# Altium schematic sheet Battery Management and Charging.SchDoc
size B; SheetNumber: 4; SheetTotal: 9
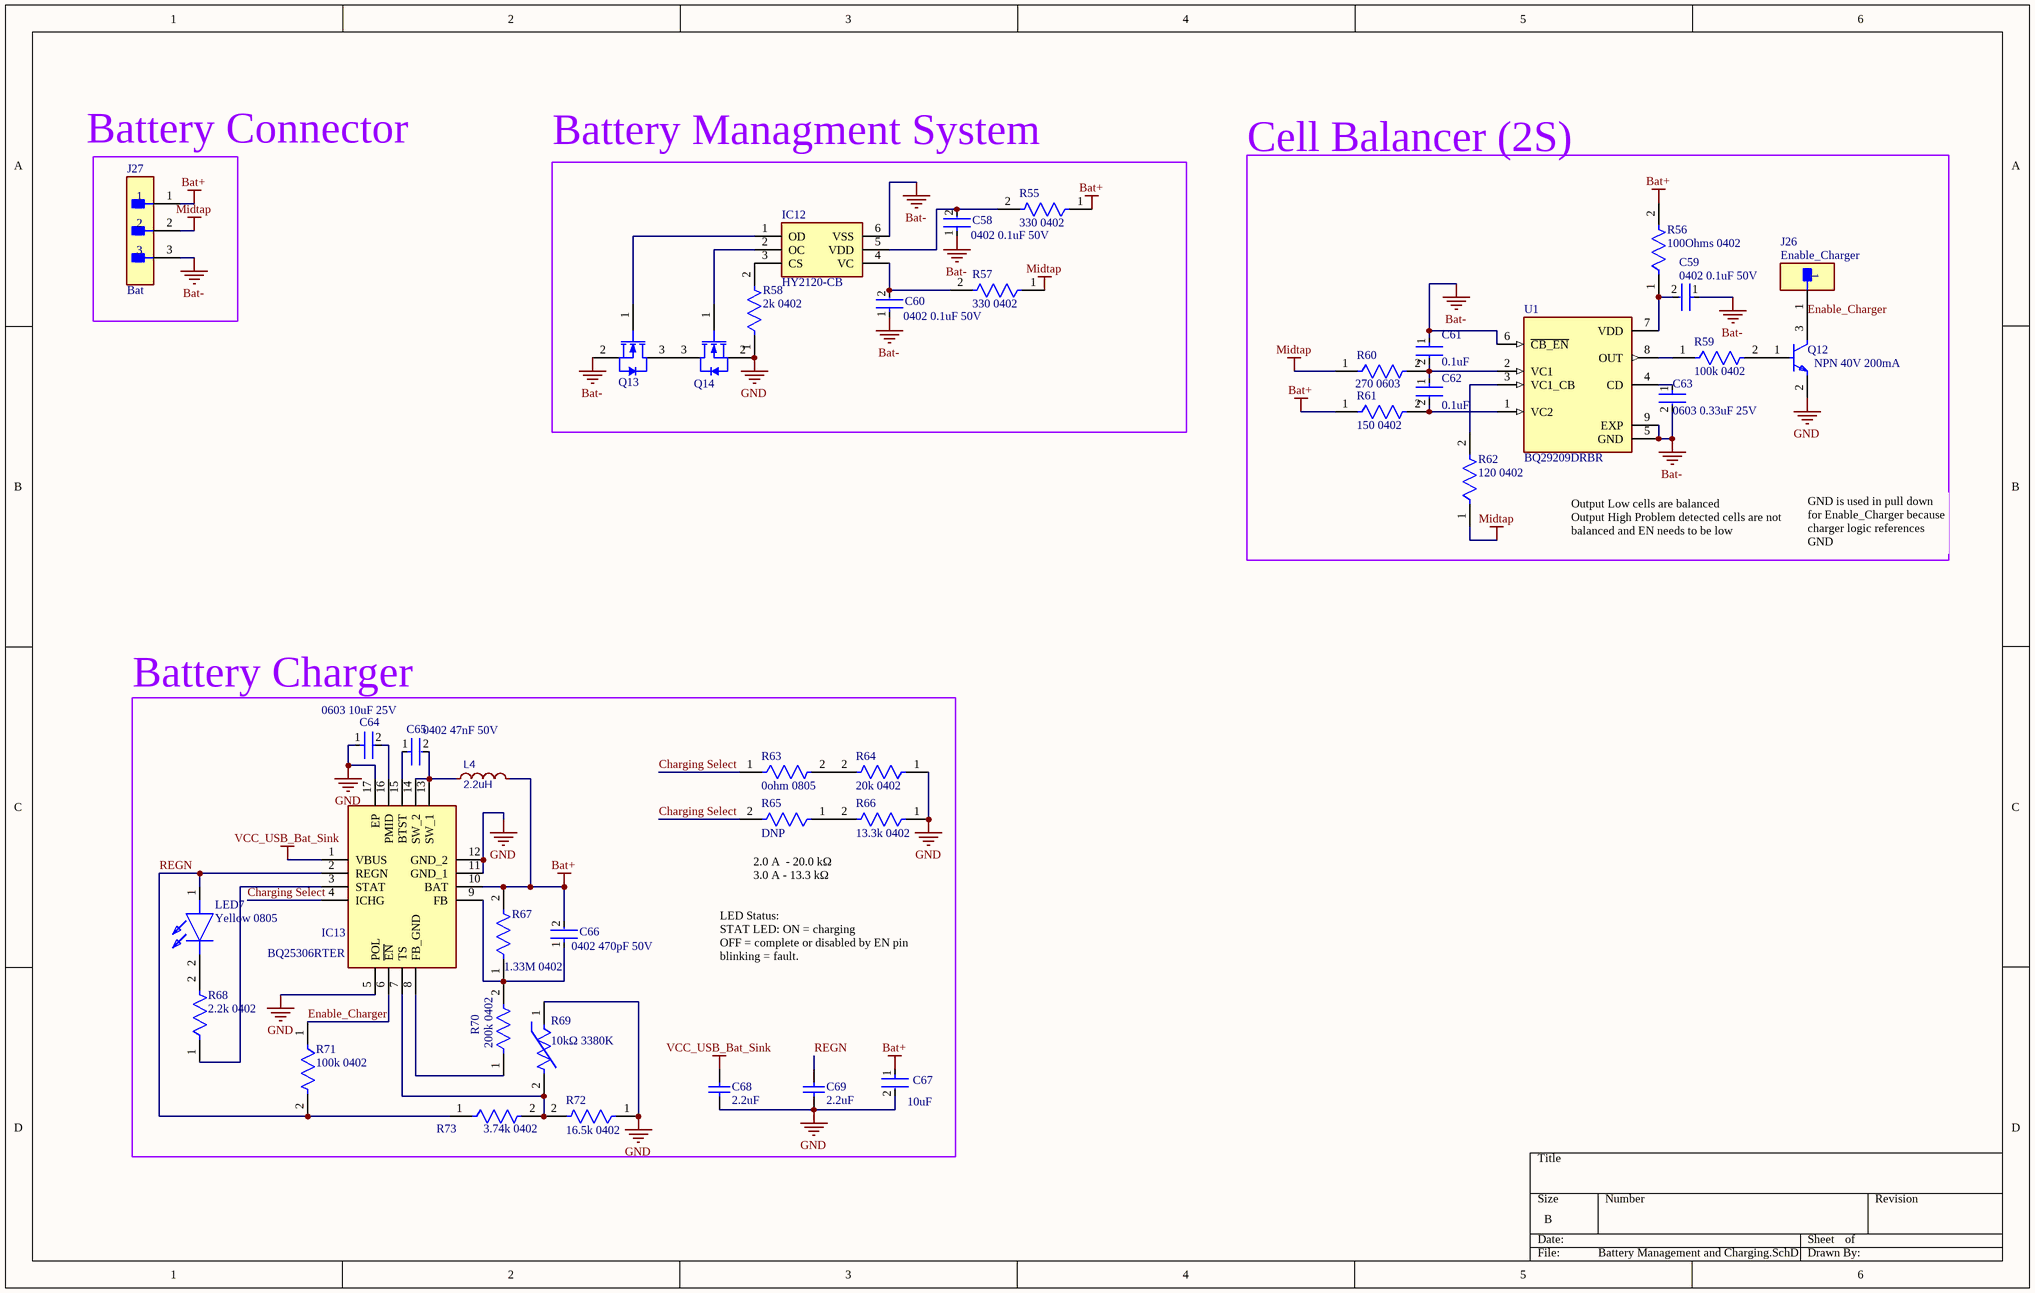
[diagram p0: Battery Management and Charging.SchDoc]

## Parts
C58  0402 0.1uF 50V  [FP-C0402-BB-MFG]
C59  0402 0.1uF 50V  [FP-C0402-BB-MFG]
C60  0402 0.1uF 50V  [FP-C0402-BB-MFG]
C61  0.1uF  [FP-C0402-BB-MFG]
C62  0.1uF  [FP-C0402-BB-MFG]
C63  0603 0.33uF 25V  [FP-CC0603-DC-MFG]
C64  0603 10uF 25V  [FP-CC0603-DC-MFG]
C65  0402 47nF 50V  [FP-C0402-BB-MFG]
C66  0402 470pF 50V  [FP-C0402-BB-MFG]
C67  10uF  [FP-CC0603-DC-MFG]
C68  2.2uF  [CAPC2013X94X50LL20T25]
C69  2.2uF  [CAPC2013X94X50LL20T25]
IC12  HY2120-CB  [SOT95P280X140-6N]
IC13  BQ25306RTER  [QFN50P300X300X80-17N-D]
J26  Enable_Charger  [FP-5015-MFG]
J27  Bat  [FP-TSW-103-14-G-S-MFG]
L4  2.2uH  [2.2uH]
LED7  Yellow 0805  [KT0805G]
Q12  NPN 40V 200mA  [FP-SOT23-IPC_A]
Q13  Discharge Protection  [ONSC-SOT-23-3-318-08_V]  (value not drawn)
Q14  Discharge Protection  [ONSC-SOT-23-3-318-08_V]  (value not drawn)
R55  330 0402  [FP-RMCF0402-MFG]
R56  100Ohms 0402  [FP-RMCF0402-MFG]
R57  330 0402  [FP-RMCF0402-MFG]
R58  2k 0402  [FP-RMCF0402-MFG]
R59  100k 0402  [FP-RMCF0402-MFG]
R60  270 0603  [FP-AC0603-MFG]
R61  150 0402  [FP-RMCF0402-MFG]
R62  120 0402  [FP-RMCF0402-MFG]
R63  0ohm 0805  [FP-RN73R2A-IPC_C]
R64  20k 0402  [FP-RMCF0402-MFG]
R65  DNP  [FP-RN73R2A-IPC_C]
R66  13.3k 0402  [FP-RMCF0402-MFG]
R67  1.33M 0402  [FP-RMCF0402-MFG]
R68  2.2k 0402  [FP-AF0402-IPC_B]
R69  10kΩ 3380K  [FP-NCP15-NCU15-0_05-IPC_A]
R70  200k 0402  [FP-RMCF0402-MFG]
R71  100k 0402  [FP-RMCF0402-MFG]
R72  16.5k 0402  [FP-RMCF0402-MFG]
R73  3.74k 0402  [FP-RMCF0402-MFG]
U1  BQ29209DRBR  [Cell Balancer]

## Blocks framed on the sheet
Battery Managment System: C58 C60 IC12 Q13 Q14 R55 R57 R58
Cell Balancer (2S): C59 C61-C63 J26 Q12 R56 R59-R62 U1
Battery Charger: C64-C69 IC13 L4 LED7 R63-R73

## Nets
Bat+: C66.2 C67.1 IC13.10(BAT) J27.1 L4.2 R55.1 R56.2 R61.1 R67.2
Bat-: C58.1 C59.1 C60.1 C61.1 C63.2 IC12.6(VSS) J27.3 Q13.2(S) U1.5(GND) U1.6(~{CB_EN}) U1.9(EXP)
GND: C64.1 C67.2 C68.1 C69.1 IC13.5(POL) IC13.11(GND_1) IC13.12(GND_2) IC13.17(EP) Q12.2(E) Q14.2(S) R58.1 R64.1 R66.1 R69.1 R72.1
Midtap: J27.2 R57.1 R60.1 R62.1
VCC_USB_Bat_Sink: C68.2 IC13.1(VBUS)
Charging Select: IC13.4(ICHG) R63.1 R65.2
Enable_Charger: IC13.6(~{EN}) J26.1 Q12.3(C) R71.1
REGN: C69.2 IC13.2(REGN) LED7.1(A) R71.2 R73.1
NetC58_2: C58.2 IC12.5(VDD) R55.2
NetC59_2: C59.2 R56.1 U1.7(VDD)
NetC60_2: C60.2 IC12.4(VC) R57.2
NetC61_2: C61.2 C62.1 R60.2 U1.2(VC1)
NetC62_2: C62.2 R61.2 U1.1(VC2)
NetC63_1: C63.1 U1.4(CD)
NetC64_2: C64.2 IC13.16(PMID)
NetC65_1: C65.1 IC13.15(BTST)
NetC65_2: C65.2 IC13.13(SW_1) IC13.14(SW_2) L4.1
NetC66_1: C66.1 IC13.9(FB) R67.1 R70.2
NetIC12_1: IC12.1(OD) Q13.1(G)
NetIC12_2: IC12.2(OC) Q14.1(G)
NetIC12_3: IC12.3(CS) R58.2
NetIC13_3: IC13.3(STAT) R68.1
NetIC13_7: IC13.7(TS) R69.2 R72.2 R73.2
NetIC13_8: IC13.8(FB_GND) R70.1
NetLED7_2: LED7.2(K) R68.2
NetQ12_1: Q12.1(B) R59.2
NetQ13_3: Q13.3(D) Q14.3(D)
NetR59_1: R59.1 U1.8(OUT)
NetR62_2: R62.2 U1.3(VC1_CB)
NetR63_2: R63.2 R64.2
NetR65_1: R65.1 R66.2

## Notes on the sheet
- (near J27) Battery Connector
- Output Low cells are balanced
  Output High Problem detected cells are not balanced and EN needs to be low
- GND is used in pull down for Enable_Charger because charger logic references GND
- 2.0 A  - 20.0 kΩ
  3.0 A - 13.3 kΩ
- LED Status:
  STAT LED: ON = charging
  OFF = complete or disabled by EN pin
  blinking = fault.

## Library data of the parts
C58-C62 = CMP-03020-014070-2: C307331; Manufacturer: Kemet; Manufacturer Part Number: C0402C104M3PAC7867; Material: Ceramic; Tolerance: 0.2; Temperature Characteristic: X5R; Value: 0.10 μF; Temperature Coefficient: 15%; Voltage Rating: 25 V; Height: 0.55mm; Category: Cap; Temperature: -55°C to +125°C; Automotive: No; Package: C0402-BB; Temperature Range Low: -55°C; ComponentLink2Description: Datasheet; Device Class L3: Ceramic Capacitors; ComponentLink2URL: https://content.kemet.com/datasheets/KEM_C1002_X7R_SMD.pdf; Octopart: https://octopart.com/c0402c104m3pac7867-kemet-84304880; RoHS: TRUE; Temperature Range High: +125°C; Device Class L1: Passive Components; Capacitance: 0.10 μF; Lead Free: Yes; Ipc Land Pattern Name: CAPC10050X50; Device Class L2: Capacitors; Digikey Description: CAP CER 0.1UF 25V X5R 0402
C63 = CMP-00621-81932632-1: C1615; Capacitance: 10µF; Voltage Rating: 16V; Dielectric: X5R; Material: Ceramic; Tolerance: 10%; NexarPartId: 81932632; Height: 1mm; Halogen Free: Halogen Free; Max Operating Temperature: 85°C; Voltage Rating (DC): 16V; Lead Free: Lead Free; RoHS: Non-Compliant; Min Operating Temperature: -55°C; Case/Package: 0603
C64 C67 = CMP-00621-81932632-1: C96446; Capacitance: 10µF; Voltage Rating: 16V; Dielectric: X5R; Material: Ceramic; Tolerance: 10%; NexarPartId: 81932632; Height: 1mm; Halogen Free: Halogen Free; Max Operating Temperature: 85°C; Voltage Rating (DC): 16V; Lead Free: Lead Free; RoHS: Non-Compliant; Min Operating Temperature: -55°C; Case/Package: 0603
C65 = CMP-03020-014070-2: C7393874; Manufacturer: Kemet; Manufacturer Part Number: C0402C104M3PAC7867; Material: Ceramic; Tolerance: 0.2; Temperature Characteristic: X5R; Value: 0.10 μF; Temperature Coefficient: 15%; Voltage Rating: 25 V; Height: 0.55mm; Category: Cap; Temperature: -55°C to +125°C; Automotive: No; Package: C0402-BB; Temperature Range Low: -55°C; ComponentLink2Description: Datasheet; Device Class L3: Ceramic Capacitors; ComponentLink2URL: https://content.kemet.com/datasheets/KEM_C1002_X7R_SMD.pdf; Octopart: https://octopart.com/c0402c104m3pac7867-kemet-84304880; RoHS: TRUE; Temperature Range High: +125°C; Device Class L1: Passive Components; Capacitance: 0.10 μF; Lead Free: Yes; Ipc Land Pattern Name: CAPC10050X50; Device Class L2: Capacitors; Digikey Description: CAP CER 0.1UF 25V X5R 0402
C66 = CMP-03020-014070-2: C1537; Manufacturer: Kemet; Manufacturer Part Number: C0402C104M3PAC7867; Material: Ceramic; Tolerance: 0.2; Temperature Characteristic: X5R; Value: 0.10 μF; Temperature Coefficient: 15%; Voltage Rating: 25 V; Height: 0.55mm; Category: Cap; Temperature: -55°C to +125°C; Automotive: No; Package: C0402-BB; Temperature Range Low: -55°C; ComponentLink2Description: Datasheet; Device Class L3: Ceramic Capacitors; ComponentLink2URL: https://content.kemet.com/datasheets/KEM_C1002_X7R_SMD.pdf; Octopart: https://octopart.com/c0402c104m3pac7867-kemet-84304880; RoHS: TRUE; Temperature Range High: +125°C; Device Class L1: Passive Components; Capacitance: 0.10 μF; Lead Free: Yes; Ipc Land Pattern Name: CAPC10050X50; Device Class L2: Capacitors; Digikey Description: CAP CER 0.1UF 25V X5R 0402
C68 C69 = CMP-2007-04160-1: C377773; Part Number: 08051C102KAT4A; Manufacturer: AVX Interconnect / Elco
IC12 = HY2120-CB: C116509; Manufacturer_Name: Hycon; Datasheet Link: https://datasheet.lcsc.com/szlcsc/HYCON-Tech-HY2120CB_C116509.pdf; Height: 1.4mm; Manufacturer_Part_Number: HY2120-CB
IC13 = BQ25306RTER: C3682611; Manufacturer_Name: Texas Instruments; Datasheet Link: https://datasheet.datasheetarchive.com/originals/distributors/Datasheets_SAMA/2f547f963ca1fcc8a9da6a9d70991dab.pdf; Height: 0.8mm; Manufacturer_Part_Number: BQ25306RTER; Mouser Part Number: 595-BQ25306RTER; Mouser Price/Stock: https://www.mouser.co.uk/ProductDetail/Texas-Instruments/BQ25306RTER?qs=81r%252BiQLm7BROlYIxj7RTtQ%3D%3D; Arrow Part Number: BQ25306RTER; Arrow Price/Stock: https://www.arrow.com/en/products/bq25306rter/texas-instruments?region=nac
J26 = CMP-2000-05183-2: PC TEST POINT MINIATURE; Manufacturer Part Number: 5015; Manufacturer: keystone; Number Of Contacts: 1; Conn Orientation: Straight; Category: Conn; Digikey Description: PC TEST POINT MINIATURE; Automotive: No; Lead Free: Yes; Octopart: https://octopart.com/5015-keystone-3822; ComponentLink2URL: http://www.keyelco.com/product-pdf.cfm?p=1353; Package: 5015; RoHS: TRUE; Device Class L3: unset; Device Class L2: unset; Contact Material: Silver; Device Class L1: Connectors; Height: 1.65mm; ComponentLink2Description: Datasheet
J27 = CMP-02766-001743-1: CONN HEADER VERT 3POS 2.54MM; Max Voltage Rating (AC): 550V; Number of Positions: 3; Max Current Rating: 7.6A; Gender: Male; Termination: Solder; RoHS Compliant: Yes; Mount: Through Hole; Lead Free: Lead Free; Connector Type: Header; REACH SVHC: No SVHC; Insulation Color: Black; Width: 2.54mm; Length: 7.62mm; Flammability Rating: UL94 V-0; Housing Material: Polyester; Contact Material: Bronze; Max Operating Temperature: 125°C; Fastening Type: Pull; Series: TSW; Number of Contacts: 3; Packaging: Bulk; Min Operating Temperature: -55°C; Package Quantity: 1; Height: 10.67mm; Pitch: 2.54mm; Contact Finish - Mating: GOLD; Contact Type: Male Pin; Radiation Hardening: No; Color: Black; Housing Color: Black; Contact Plating: Gold; Orientation: Straight; Number of Rows: 1; Depth: 2.54mm; Insulation Material: PBT; Contact Mating Length: 0.32inch; Contact Shape: Square
L4 = 2.2uH: C177247; Manufacturer: cjiang(长江微电); Manufacturer Part: FXL0530-2R2-M; nameAlias: Value; Contributor: LCSC; Supplier: LCSC; Supplier Part: C177247; JLCPCB Part Class: Extended Part; spicePre: L; spiceSymbolName: FXL0530-2R2-M
LED7 = KT-0805G: C2296; Manufacturer_Name: Hubei KENTO Elec; Datasheet Link: https://jlcpcb.com/api/file/downloadByFileSystemAccessId/8639582106239348736; Height: 0.95mm; Manufacturer_Part_Number: KT-0805G
Q12 = CMP-2000-04931-2: C364310; Frequency: 300MHz; Power Dissipation: 350mW; Element Configuration: Single; Max Power Dissipation: 300mW; Collector Emitter Saturation Voltage: 300mV; Number of Elements: 1; hFE Min: 100; Collector Base Voltage (VCBO): 60V; Emitter Base Voltage (VEBO): 6V; Contact Plating: Tin; Package Quantity: 3000; Max Frequency: 300MHz; REACH SVHC: No SVHC; Max Operating Temperature: 150°C; Width: 1.4mm; Collector Emitter Voltage (VCEO): 40V; Voltage Rating (DC): 40V; Radiation Hardening: No; Case/Package: SOT-23; Height: 1mm; Collector Emitter Breakdown Voltage: 40V; Length: 3.05mm; Polarity: NPN; Packaging: Tape and Reel; Number of Pins: 3; Min Operating Temperature: -55°C; Gain Bandwidth Product: 300MHz; Mount: Surface Mount; Max Collector Current: 200mA; Weight: 0.000282oz; Continuous Collector Current: 200mA; Transition Frequency: 300MHz; Max Breakdown Voltage: 40V; Lead Free: Lead Free
Q13 Q14 = CMP-1058-00781-1: C20917; Manufacturer: On Semiconductor; PartNumber: 2N7002LT1G; Channel Polarity: N Channel; V(BR)DSS Min (V): 60; ID Max (A): 0.115; VGS Max (V): 20; Configuration: Single; VGS(th) Max (V): 2.5; Packing: Tape and Reel; ComponentLink1URL: http://www.onsemi.com/; ComponentLink3Description: Package Specification; ComponentLink3URL: http://www.onsemi.cn/pub_link/Collateral/318-08.PDF; PackageReference: SOT-23-3-318-08; RoHS: Pb-Free; ComponentLink2URL: http://www.onsemi.com/pub_link/Collateral/2N7002L-D.PDF; ComponentLink1Description: Manufacturer URL; Package Type: SOT-23-3; DatasheetVersion: Rev. 7; Mounting Technology: Surface Mount; ComponentLink2Description: Datasheet; PackageDescription: 3-Pin Small Outline Transistor, Body 2.92 x 1.3 mm, Pitch 0.95 mm; PackageVersion: Rev. AP, 11/2009
R55 R57 = CMP-26527-002093-1: C25104; Max Power Dissipation: 63mW; Tolerance: 5%; Resistance: 3.9R; Temperature Coefficient: 200ppm/°C; Case/Package: 0402; Number of Terminations: 2; Min Operating Temperature: -55°C; Height: 0.016inch; Packaging: Tape and Reel; Resistor Type: Thick Film; Length: 0.039inch; Mount: Surface Mount; Series: RMCF; Max Operating Temperature: 155°C; Contact Plating: Tin; Features: Automotive AEC-Q200; Width: 0.02inch; Radiation Hardening: No; RoHS Compliant: Yes
R56 = CMP-26527-002093-1: C25076; Max Power Dissipation: 63mW; Tolerance: 5%; Resistance: 3.9R; Temperature Coefficient: 200ppm/°C; Case/Package: 0402; Number of Terminations: 2; Min Operating Temperature: -55°C; Height: 0.016inch; Packaging: Tape and Reel; Resistor Type: Thick Film; Length: 0.039inch; Mount: Surface Mount; Series: RMCF; Max Operating Temperature: 155°C; Contact Plating: Tin; Features: Automotive AEC-Q200; Width: 0.02inch; Radiation Hardening: No; RoHS Compliant: Yes
R58 = CMP-26527-002093-1: C4109; Max Power Dissipation: 63mW; Tolerance: 5%; Resistance: 3.9R; Temperature Coefficient: 200ppm/°C; Case/Package: 0402; Number of Terminations: 2; Min Operating Temperature: -55°C; Height: 0.016inch; Packaging: Tape and Reel; Resistor Type: Thick Film; Length: 0.039inch; Mount: Surface Mount; Series: RMCF; Max Operating Temperature: 155°C; Contact Plating: Tin; Features: Automotive AEC-Q200; Width: 0.02inch; Radiation Hardening: No; RoHS Compliant: Yes
R59 R71 = CMP-26527-002093-1: C25741; Max Power Dissipation: 63mW; Tolerance: 5%; Resistance: 3.9R; Temperature Coefficient: 200ppm/°C; Case/Package: 0402; Number of Terminations: 2; Min Operating Temperature: -55°C; Height: 0.016inch; Packaging: Tape and Reel; Resistor Type: Thick Film; Length: 0.039inch; Mount: Surface Mount; Series: RMCF; Max Operating Temperature: 155°C; Contact Plating: Tin; Features: Automotive AEC-Q200; Width: 0.02inch; Radiation Hardening: No; RoHS Compliant: Yes
R60 = CMP-03412-043951-1: C22966; Power Rating: 100mW; Voltage Rating: 50V; Resistance: 3MR; Temperature Coefficient: 100ppm/°C; Tolerance: 1%; Number of Terminations: 2; Case Code (Metric): 1608; Resistor Type: Thick Film; Termination: SMD/SMT; Case/Package: 0603; RoHS Compliant: Yes; Features: Moisture Resistant; Max Power Dissipation: 100mW; Case Code (Imperial): 0603; Max Operating Temperature: 155°C; Width: 0.8mm; Packaging: Tape and Reel; Length: 0.063inch; Min Operating Temperature: -55°C; Series: AC; Height: 0.022inch
R61 = CMP-26527-002093-1: C25082; Max Power Dissipation: 63mW; Tolerance: 5%; Resistance: 3.9R; Temperature Coefficient: 200ppm/°C; Case/Package: 0402; Number of Terminations: 2; Min Operating Temperature: -55°C; Height: 0.016inch; Packaging: Tape and Reel; Resistor Type: Thick Film; Length: 0.039inch; Mount: Surface Mount; Series: RMCF; Max Operating Temperature: 155°C; Contact Plating: Tin; Features: Automotive AEC-Q200; Width: 0.02inch; Radiation Hardening: No; RoHS Compliant: Yes
R62 = CMP-26527-002093-1: C25079; Max Power Dissipation: 63mW; Tolerance: 5%; Resistance: 3.9R; Temperature Coefficient: 200ppm/°C; Case/Package: 0402; Number of Terminations: 2; Min Operating Temperature: -55°C; Height: 0.016inch; Packaging: Tape and Reel; Resistor Type: Thick Film; Length: 0.039inch; Mount: Surface Mount; Series: RMCF; Max Operating Temperature: 155°C; Contact Plating: Tin; Features: Automotive AEC-Q200; Width: 0.02inch; Radiation Hardening: No; RoHS Compliant: Yes
R63 = CMP-04015-014497-1: C17477
R64 = CMP-26527-002093-1: C25765; Max Power Dissipation: 63mW; Tolerance: 5%; Resistance: 3.9R; Temperature Coefficient: 200ppm/°C; Case/Package: 0402; Number of Terminations: 2; Min Operating Temperature: -55°C; Height: 0.016inch; Packaging: Tape and Reel; Resistor Type: Thick Film; Length: 0.039inch; Mount: Surface Mount; Series: RMCF; Max Operating Temperature: 155°C; Contact Plating: Tin; Features: Automotive AEC-Q200; Width: 0.02inch; Radiation Hardening: No; RoHS Compliant: Yes
R65 = CMP-04015-014497-1: DNP 0805
R66 = CMP-26527-002093-1: C2974007; Max Power Dissipation: 63mW; Tolerance: 5%; Resistance: 3.9R; Temperature Coefficient: 200ppm/°C; Case/Package: 0402; Number of Terminations: 2; Min Operating Temperature: -55°C; Height: 0.016inch; Packaging: Tape and Reel; Resistor Type: Thick Film; Length: 0.039inch; Mount: Surface Mount; Series: RMCF; Max Operating Temperature: 155°C; Contact Plating: Tin; Features: Automotive AEC-Q200; Width: 0.02inch; Radiation Hardening: No; RoHS Compliant: Yes
R67 = CMP-26527-002093-1: C5713265; Max Power Dissipation: 63mW; Tolerance: 5%; Resistance: 3.9R; Temperature Coefficient: 200ppm/°C; Case/Package: 0402; Number of Terminations: 2; Min Operating Temperature: -55°C; Height: 0.016inch; Packaging: Tape and Reel; Resistor Type: Thick Film; Length: 0.039inch; Mount: Surface Mount; Series: RMCF; Max Operating Temperature: 155°C; Contact Plating: Tin; Features: Automotive AEC-Q200; Width: 0.02inch; Radiation Hardening: No; RoHS Compliant: Yes
R68 = CMP-03412-049911-1: C25879; Resistance: 4.3kR; Max Power Dissipation: 63mW; Temperature Coefficient: 100ppm/°C; Tolerance: 5%; Case/Package: 0402; Height: 0.015inch; Width: 0.02inch; Min Operating Temperature: -55°C; Packaging: Tape and Reel; Max Operating Temperature: 155°C; Features: Moisture Resistant; Series: AF; Number of Terminations: 2; Length: 0.039inch; Resistor Type: Thick Film; RoHS Compliant: Yes
R69 = CMP-06022-000215-2: C178739
R70 = CMP-26527-002093-1: C25764; Max Power Dissipation: 63mW; Tolerance: 5%; Resistance: 3.9R; Temperature Coefficient: 200ppm/°C; Case/Package: 0402; Number of Terminations: 2; Min Operating Temperature: -55°C; Height: 0.016inch; Packaging: Tape and Reel; Resistor Type: Thick Film; Length: 0.039inch; Mount: Surface Mount; Series: RMCF; Max Operating Temperature: 155°C; Contact Plating: Tin; Features: Automotive AEC-Q200; Width: 0.02inch; Radiation Hardening: No; RoHS Compliant: Yes
R72 = CMP-26527-002093-1: C226807; Max Power Dissipation: 63mW; Tolerance: 5%; Resistance: 3.9R; Temperature Coefficient: 200ppm/°C; Case/Package: 0402; Number of Terminations: 2; Min Operating Temperature: -55°C; Height: 0.016inch; Packaging: Tape and Reel; Resistor Type: Thick Film; Length: 0.039inch; Mount: Surface Mount; Series: RMCF; Max Operating Temperature: 155°C; Contact Plating: Tin; Features: Automotive AEC-Q200; Width: 0.02inch; Radiation Hardening: No; RoHS Compliant: Yes
R73 = CMP-26527-002093-1: C2986585; Max Power Dissipation: 63mW; Tolerance: 5%; Resistance: 3.9R; Temperature Coefficient: 200ppm/°C; Case/Package: 0402; Number of Terminations: 2; Min Operating Temperature: -55°C; Height: 0.016inch; Packaging: Tape and Reel; Resistor Type: Thick Film; Length: 0.039inch; Mount: Surface Mount; Series: RMCF; Max Operating Temperature: 155°C; Contact Plating: Tin; Features: Automotive AEC-Q200; Width: 0.02inch; Radiation Hardening: No; RoHS Compliant: Yes
U1 = BQ29209DRBR: C139352; MF: Texas Instruments; SnapEDA_Link: https://www.snapeda.com/parts/BQ29209DRBR/Texas+Instruments/view-part/?ref=snap; Package: VSON-8 Texas Instruments; Value: *; MP: BQ29209DRBR; Check_prices: https://www.snapeda.com/parts/BQ29209DRBR/Texas+Instruments/view-part/?ref=eda